# EAGLE design sequence_panel (EAGLE 9.6.0)
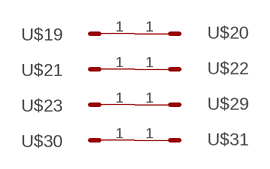
[diagram p0: schematic, sheet 1]

## Parts
U$19  HEADER/MALE/01  [HEADER/MALE/01]
U$20  HEADER/MALE/01  [HEADER/MALE/01]
U$21  HEADER/MALE/01  [HEADER/MALE/01]
U$22  HEADER/MALE/01  [HEADER/MALE/01]
U$23  HEADER/MALE/01  [HEADER/MALE/01]
U$29  HEADER/MALE/01  [HEADER/MALE/01]
U$30  HEADER/MALE/01  [HEADER/MALE/01]
U$31  HEADER/MALE/01  [HEADER/MALE/01]

## Nets
N$1: U$19.1 U$20.1
N$2: U$21.1 U$22.1
N$3: U$23.1 U$29.1
N$4: U$30.1 U$31.1

## Library data of the parts
U$19-U$23 U$29-U$31 = connectors:HEADER/MALE/01

## Board
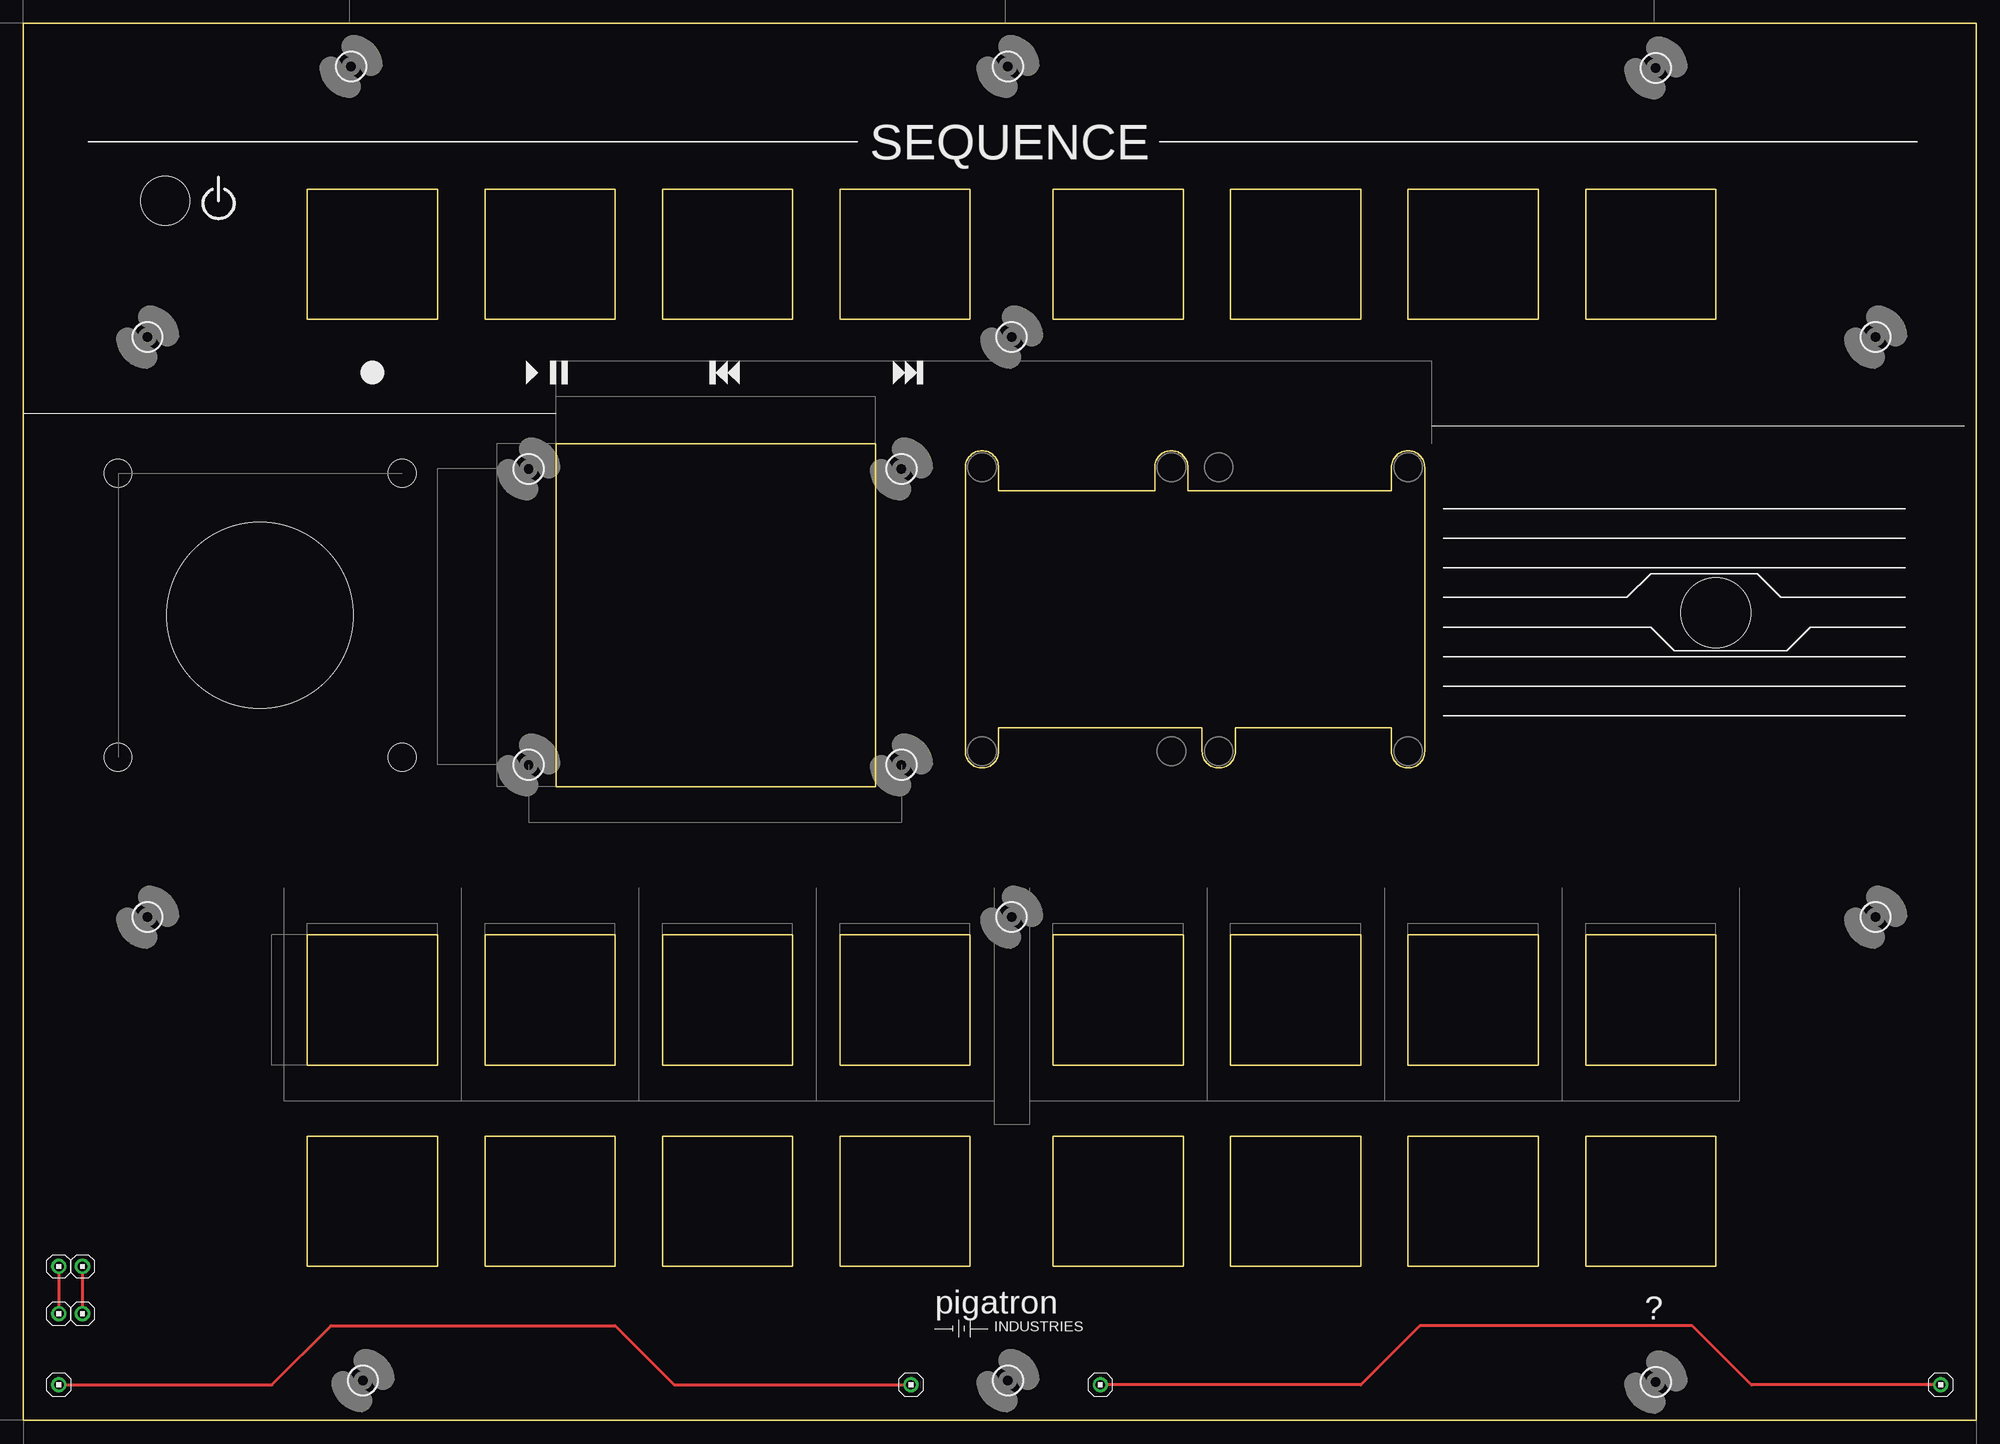
[diagram p1: board, top side]

Size 209.55 x 149.86 mm. Coordinates in mm from the lower left corner, seen from the top.
Outline: 101.09,71.75 101.09,102.23 arc-180 104.65,102.23 104.65,99.69 121.41,99.69 121.41,102.23 arc-180 124.97,102.23 124.97,99.69 146.81,99.69 146.81,102.23 arc-180 150.37,102.23 150.37,71.75 arc-180 146.81,71.75 146.81,74.3 130.05,74.3 130.05,71.75 arc-180 126.49,71.75 126.49,74.3 104.65,74.3 104.65,71.75
Outline: 104.65,71.75 arc-180 101.09,71.75
Outline: 104.65,71.75 arc-180 101.09,71.75
Outline: 0,0 0,149.86 209.55,149.86 209.55,0 0,0
Outline: 57.15,104.78 57.15,67.94 91.44,67.94 91.44,104.78 57.15,104.78
Outline: 30.48,52.07 44.45,52.07 44.45,38.1 30.48,38.1 30.48,52.07
Outline: 49.53,52.07 63.5,52.07 63.5,38.1 49.53,38.1 49.53,52.07
Outline: 68.58,52.07 82.55,52.07 82.55,38.1 68.58,38.1 68.58,52.07
Outline: 87.63,52.07 101.6,52.07 101.6,38.1 87.63,38.1 87.63,52.07
Outline: 110.49,52.07 124.46,52.07 124.46,38.1 110.49,38.1 110.49,52.07
Outline: 129.54,52.07 143.51,52.07 143.51,38.1 129.54,38.1 129.54,52.07
Outline: 148.59,52.07 162.56,52.07 162.56,38.1 148.59,38.1 148.59,52.07
Outline: 167.64,52.07 181.61,52.07 181.61,38.1 167.64,38.1 167.64,52.07
Outline: 30.48,30.48 44.45,30.48 44.45,16.51 30.48,16.51 30.48,30.48
Outline: 49.53,30.48 63.5,30.48 63.5,16.51 49.53,16.51 49.53,30.48
Outline: 68.58,30.48 82.55,30.48 82.55,16.51 68.58,16.51 68.58,30.48
Outline: 87.63,30.48 101.6,30.48 101.6,16.51 87.63,16.51 87.63,30.48
Outline: 110.49,30.48 124.46,30.48 124.46,16.51 110.49,16.51 110.49,30.48
Outline: 129.54,30.48 143.51,30.48 143.51,16.51 129.54,16.51 129.54,30.48
Outline: 148.59,30.48 162.56,30.48 162.56,16.51 148.59,16.51 148.59,30.48
Outline: 167.64,30.48 181.61,30.48 181.61,16.51 167.64,16.51 167.64,30.48
Outline: 30.48,132.08 44.45,132.08 44.45,118.11 30.48,118.11 30.48,132.08
Outline: 49.53,132.08 63.5,132.08 63.5,118.11 49.53,118.11 49.53,132.08
Outline: 68.58,132.08 82.55,132.08 82.55,118.11 68.58,118.11 68.58,132.08
Outline: 87.63,132.08 101.6,132.08 101.6,118.11 87.63,118.11 87.63,132.08
Outline: 110.49,132.08 124.46,132.08 124.46,118.11 110.49,118.11 110.49,132.08
Outline: 129.54,132.08 143.51,132.08 143.51,118.11 129.54,118.11 129.54,132.08
Outline: 148.59,132.08 162.56,132.08 162.56,118.11 148.59,118.11 148.59,132.08
Outline: 167.64,132.08 181.61,132.08 181.61,118.11 167.64,118.11 167.64,132.08
Copper layers (1*16): Top 0.0356mm / dielectric 1.5011mm / Bottom 0.0356mm
Design rules "pigatron": minimum track width 12mil, minimum drill 13mil, track to track 15mil, track to pad 10mil, pad to pad 10mil, via to via 10mil, smd to smd 6mil, copper to edge 15mil, drill to drill 10mil, minimum pad ring 12mil, minimum via ring 10mil, stop-mask expansion 4mil, vias tented up to drill 0mil, thermal gap 10mil
Holes 20 mm at 25.4,86.36
Holes 3 mm at 10.16,101.6 10.16,71.12 40.64,101.6 40.64,71.12
Holes 7.5 mm at 181.61,86.61
Holes 5.28 mm at 15.24,130.81

### Footprints (pad centres in the part's own frame; a part is rotated, then mirrored left to right if it is on the bottom)
STANDOFF/3.0 = hole 3: 0,0
HEADER/MALE/01 = drill 1.016: 1 0,0

### Placement (x,y rotation side)
U$1  [STANDOFF/3.0]  13.34,116.2 0 top
U$2  [STANDOFF/3.0]  94.22,102.06 0 top
U$3  [STANDOFF/3.0]  13.34,53.98 0 top
U$4  [STANDOFF/3.0]  106.05,53.98 0 top
U$5  [STANDOFF/3.0]  198.75,116.2 0 top
U$6  [STANDOFF/3.0]  105.66,4.27 0 top
U$7  [STANDOFF/3.0]  54.22,102.06 0 top
U$8  [STANDOFF/3.0]  106.05,116.2 0 top
U$9  [STANDOFF/3.0]  105.66,145.24 0 top
U$10  [STANDOFF/3.0]  198.75,53.98 0 top
U$11  [STANDOFF/3.0]  175.17,145.08 0 top
U$12  [STANDOFF/3.0]  35.17,145.24 0 top
U$13  [PIGATRON-LOGO]  106.68,11.43 0 top
U$14  [PIGATRON-LOGO]  105.09,11.43 0 bottom
U$15  [STANDOFF/3.0]  94.22,70.31 0 top
U$16  [STANDOFF/3.0]  54.22,70.31 0 top
U$17  [STANDOFF/3.0]  36.44,4.27 0 top
U$18  [STANDOFF/3.0]  175.17,4.11 0 top
U$19  6.35,11.43 0 top
U$20  6.35,16.51 0 top
U$21  3.81,16.51 0 top
U$22  3.81,11.43 0 top
U$23  205.74,3.81 0 top
U$29  115.57,3.81 0 top
U$30  3.81,3.81 0 top
U$31  95.25,3.81 0 top

### Tracks (layer width: path | path; a pad name or v marks a point on that pad's centre or on a via)
N$1
  Top 0.305: U$20.1 U$19.1
N$2
  Top 0.305: U$21.1 U$22.1
N$3
  Top 0.305: U$23.1 185.42,3.81 179.07,10.16 149.86,10.16 143.51,3.81 U$29.1
N$4
  Top 0.305: U$30.1 26.67,3.81 33.02,10.16 63.5,10.16 69.85,3.81 U$31.1

### Text on the board
tNames: SEQUENCE | ?
bNames: JLCJLCJLCJLC | Rob Ellis 2020
tDocu: SEQUENCE